# Altium schematic sheet POWER SUPPLY.SchDoc
size 474 x 261 mm
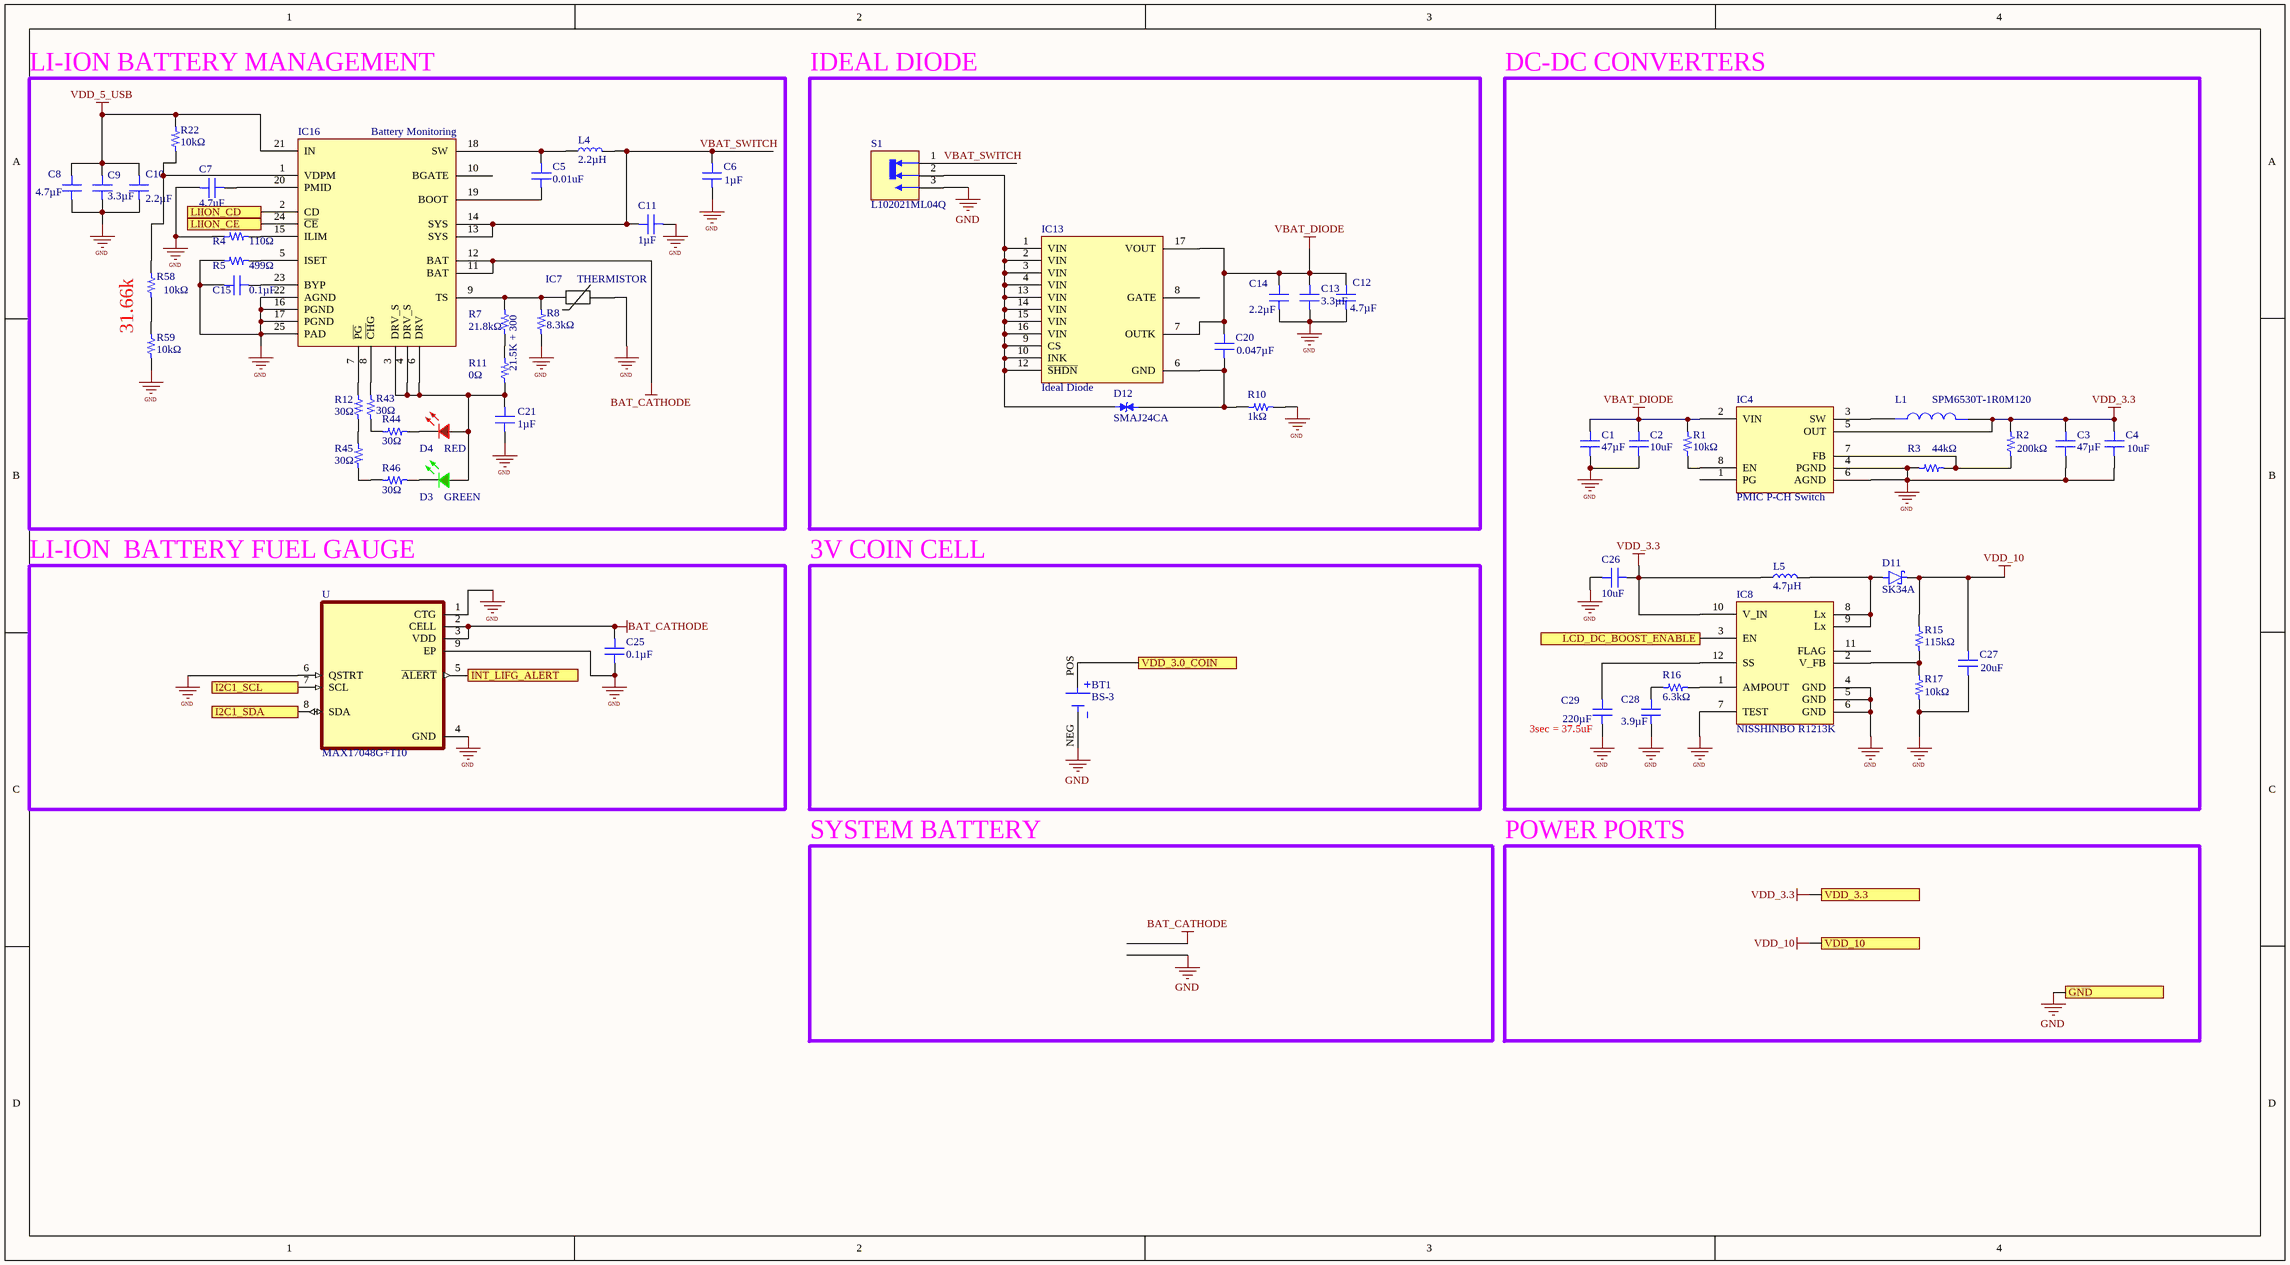
[diagram p0: POWER SUPPLY.SchDoc]

## Parts
BT1  BS-3  [BAT_BS-3]
C1  47µF  [CAP 1210_3225 - 2.2MM]
C2  10uF  [CAP 0603_1608]
C3  47µF  [CAP 1210_3225 - 2.2MM]
C4  10uF  [CAP 0603_1608]
C5  0.01uF  [CAP 0603_1608]
C6  1µF  [CAP 0603_1608]
C7  4.7uF  [CAP 0603_1608]
C8  4.7µF  [CAP 0805_2012]
C9  3.3µF  [0805_2012 RF]  (no BOM)
C10  2.2µF  [CAP 0603_1608]
C11  1µF  [CAP 0603_1608]
C12  4.7µF  [CAP 0805_2012]
C13  3.3µF  [0805_2012 RF]  (no BOM)
C14  2.2µF  [CAP 0603_1608]
C15  0.1µF  [CAP 0603_1608 RF]
C20  0.047µF  [CAP 0603_1608]
C21  1µF  [CAP 0603_1608]
C25  0.1µF  [CAP 0603_1608 RF]
C26  10uF  [CAP 0603_1608]
C27  20uF  [CAP 0603_1608]
C28  3.9µF  [CAP 0805_2012]
C29  220µF  [CAP 0805_2012]
D3  GREEN  [LED 0603_1608]
D4  RED  [LED 0603_1608]
D11  SK34A  [DIOM4325X250N]
D12  SMAJ24CA  [DIOM4325X250N]
IC4  PMIC P-CH Switch  [MPS MP2144 TSOT23-8]
IC7  THERMISTOR  [THERMISTOR 2TH]
IC8  NISSHINBO R1213K  [NISSHINBO R1213K]
IC13  Ideal Diode  [ANALOG DFN-16]
IC16  Battery Monitoring  [TI BQ24278]
L1  SPM6530T-1R0M120  [IND_SPM6530T-1R0M120]
L4  2.2µH  [IND 0806_2016]
L5  4.7µH  [NTC 0603_1608]
R1  10kΩ  [RES 0603_1608 RF]
R2  200kΩ  [RES 0603_1608 RF]
R3  44kΩ  [RES 0603_1608 RF]
R4  110Ω  [RES 0603_1608 RF]
R5  499Ω  [RES 0603_1608 RF]
R7  21.8kΩ  [RES 0603_1608 RF]
R8  8.3kΩ  [RES 0603_1608 RF]
R10  1kΩ  [RES 0603_1608 RF]
R11  0Ω  [RES 0603_1608 RF]
R12  30Ω  [RES 0603_1608 RF]
R15  115kΩ  [RES 0603_1608 RF]
R16  6.3kΩ  [RES 0603_1608 RF]
R17  10kΩ  [RES 0603_1608 RF]
R22  10kΩ  [RES 0603_1608 RF]
R43  30Ω  [RES 0603_1608 RF]
R44  30Ω  [RES 0603_1608 RF]
R45  30Ω  [RES 0603_1608 RF]
R46  30Ω  [RES 0603_1608 RF]
R58  10kΩ  [RES 0603_1608 RF]
R59  10kΩ  [RES 0603_1608 RF]
S1  L102021ML04Q  [SW_L102021ML04Q]
U  MAX17048G+T10  [SON50P200X200X80-9N]

## Blocks framed on the sheet
LI-ION BATTERY MANAGEMENT: C5-C11 C15 C21 D3 D4 IC7 IC16 L4 R4 R5 R7 R8 R11 R12 R22 R43-R46 R58 R59
IDEAL DIODE: C12-C14 C20 D12 IC13 R10 S1
DC-DC CONVERTERS: C1-C4 C26-C29 D11 IC4 IC8 L1 L5 R1-R3 R15-R17
LI-ION  BATTERY FUEL GAUGE: C25 U
3V COIN CELL: BT1

## Ports
GND, I2C1_SCL, I2C1_SDA, INT_LIFG_ALERT, LCD_DC_BOOST_ENABLE, LIION_CD, LIION_CE, VDD_3.0_COIN, VDD_3.3, VDD_10

## Nets
BAT_CATHODE: C25.2 IC16.11(BAT) IC16.12(BAT) U.2(CELL) U.3(VDD)
GND: BT1.NEG C1.1 C2.1 C3.1 C4.1 C6.1 C7.2 C8.1 C9.1 C10.1 C11.1 C12.1 C13.1 C14.1 C15.1 C21.1 C25.1 C26.1 C27.1 C28.1 C29.1 IC4.4(PGND) IC4.6(AGND) IC7.2 IC8.4(GND) IC8.5(GND) IC8.6(GND) IC8.7(TEST) IC16.16(PGND) IC16.17(PGND) IC16.22(AGND) IC16.25(PAD) R3.1 R4.1 R5.1 R8.2 R10.1 R17.1 R59.2 S1.3 U.1(CTG) U.4(GND) U.6(QSTRT) U.9(EP) ; port GND
VBAT_DIODE: C1.2 C2.2 C12.2 C13.2 C14.2 C20.2 IC4.2(VIN) IC13.7(OUTK) IC13.17(VOUT) R1.2
VDD_3.3: C3.2 C4.2 C26.2 IC4.5(OUT) IC8.10(V_IN) L1.2 L5.1 R2.2 ; port VDD_3.3
VDD_5_USB: C8.2 C9.2 C10.2 IC16.21(IN) R22.1
VDD_10: C27.2 D11.C(K) R15.2 ; port VDD_10
I2C1_SCL: U.7(SCL) ; port I2C1_SCL
I2C1_SDA: U.8(SDA) ; port I2C1_SDA
INT_LIFG_ALERT: U.5(~{ALERT}) ; port INT_LIFG_ALERT
LCD_DC_BOOST_ENABLE: IC8.3(EN) ; port LCD_DC_BOOST_ENABLE
LIION_CD: IC16.2(CD) ; port LIION_CD
LIION_CE: IC16.24(~{CE}) ; port LIION_CE
VBAT_SWITCH: C6.2 C11.2 IC16.13(SYS) IC16.14(SYS) L4.2 S1.1
VDD_3.0_COIN: BT1.POS ; port VDD_3.0_COIN
NetC5_1: C5.1 IC16.19(BOOT)
NetC5_2: C5.2 IC16.18(SW) L4.1
NetC7_1: C7.1 IC16.20(PMID)
NetC15_2: C15.2 IC16.23(BYP)
NetC20_1: C20.1 D12.2 IC13.6(GND) R10.2
NetC21_2: C21.2 D3.1 D4.1 IC16.3(DRV_S) IC16.4(DRV_S) IC16.6(DRV) R11.1
NetC28_2: C28.2 R16.1
NetC29_2: C29.2 IC8.12(SS)
NetD3_2: D3.2 R46.1
NetD4_2: D4.2 R44.1
NetD11_A: D11.A IC8.8(Lx) IC8.9(Lx) L5.2
NetD12_1: D12.1 IC13.1(VIN) IC13.2(VIN) IC13.3(VIN) IC13.4(VIN) IC13.9(CS) IC13.10(INK) IC13.12(~{SHDN}) IC13.13(VIN) IC13.14(VIN) IC13.15(VIN) IC13.16(VIN) S1.2
NetIC4_3: IC4.3(SW) L1.1
NetIC4_7: IC4.7(FB) R2.1 R3.2
NetIC4_8: IC4.8(EN) R1.1
NetIC7_1: IC7.1 IC16.9(TS) R7.2 R8.1
NetIC8_1: IC8.1(AMPOUT) R16.2
NetIC8_2: IC8.2(V_FB) R15.1 R17.2
NetIC16_1: IC16.1(VDPM) R22.2 R58.2
NetIC16_5: IC16.5(ISET) R5.2
NetIC16_7: IC16.7(~{PG}) R12.2
NetIC16_8: IC16.8(~{CH}G) R43.2
NetIC16_15: IC16.15(ILIM) R4.2
NetR7_1: R7.1 R11.2
NetR12_1: R12.1 R45.2
NetR43_1: R43.1 R44.2
NetR45_1: R45.1 R46.2
NetR58_1: R58.1 R59.1

Not connected (* = marked no-connect by the designer): IC4 1(PG); IC8 11(FLAG); IC13 8(GATE); IC16 10(BGATE)

## Notes on the sheet
- 31.66k
- 21.5K + 300
- (near C29) 3sec = 37.5uF
- SYSTEM BATTERY
- POWER PORTS
- Title
- Size:
- Date:
- File:
- A2
- Number:
- Time:
- Revision:
- Sheet
- of

## Library data of the parts
BT1 = BS-3: Holder Coincell 2032 Retainr Arm; MF: MPD (Memory; Price: None; Availability: Warning; Package: None; MP: BS-3; Value: *; SnapEDA_Link: https://www.snapeda.com/parts/BS-3/Memory%20Protection%20Devices/view-part/2280959/?ref=snap
C1 C3 = CAP00038: CAP CER 47UF 10V X7R 1210; Manufacturer: Murata Electronics; Manufacturer P/N: GRM32ER71A476ME15L; Tolerance: ±20%; Device ID: CAP00038; Mounting Type: Surface Mount; Part Type: Capacitor; VALUE: 47µF; Operating Temperature: -55°C ~ 125°C; Voltage: 10V; Package: 1210 (3225 Metric); Supplier1: Digi-Key; Supplier1 P/N: 490-6543-1-ND; Supplier2: Mouser; Supplier2 P/N: 81-GRM32ER71A476ME5L; Temperature Coefficient: X7R
C2 C4 C26 = CAP00045: CAP CER 10UF 6.3V X7R 0603; Manufacturer: TDK; Manufacturer P/N: C2012JB0J106M; Tolerance: ±10%; Device ID: CAP00045; Mounting Type: Surface Mount; Part Type: Capacitor; VALUE: 10uF; Operating Temperature: -55°C ~ 125°C; Voltage: 6.3V; Package: 0603 (1608 Metric); Supplier1: Digi-Key; Supplier1 P/N: 399-7891-1-ND; Supplier2: Mouser; Supplier2 P/N: 80-C0603C273K3R; Temperature Coefficient: X7R
C5 = CAP00049: CAP CER 0.01UF 25V X7R 0603; Manufacturer: TDK; Manufacturer P/N: C2012X5R1C106K; Tolerance: ±10%; Device ID: CAP00049; Mounting Type: Surface Mount; Part Type: Capacitor; VALUE: 0.01uF; Operating Temperature: -55°C ~ 125°C; Voltage: 25V; Package: 0603 (1608 Metric); Supplier1: Digi-Key; Supplier1 P/N: 399-7891-1-ND; Supplier2: Mouser; Supplier2 P/N: 80-C0603C273K3R; Temperature Coefficient: X7R
C6 C11 C21 = CAP00007: CAP CER 1UF 10V X7R 0603; Manufacturer: KEMET; Manufacturer P/N: C0603C105K8RACTU; Tolerance: ±10%; Device ID: CAP00007; Mounting Type: Surface Mount; Part Type: Capacitor; VALUE: 1µF; Operating Temperature: -55°C ~ 125°C; Voltage: 10V; Package: 0603 (1608 Metric); Supplier1: Digi-Key; Supplier1 P/N: 399-11133-1-ND; Supplier2: Mouser; Supplier2 P/N: 80-C0603C105K8R; Temperature Coefficient: X7R
C7 = CAP00044: CAP CER 4.7UF 50V X7R 0603; Manufacturer: KEMET; Manufacturer P/N: CL10A475KQ8NNNC; Voltage: 25V; Tolerance: ±10%; Device ID: CAP00044; Mounting Type: Surface Mount; Part Type: Capacitor; VALUE: 4.7uF; Operating Temperature: -55°C ~ 125°C; Package: 0603 (1608 Metric); Supplier1: Digi-Key; Supplier1 P/N: 399-7891-1-ND; Supplier2: Mouser; Supplier2 P/N: 80-C0603C273K3R; Temperature Coefficient: X7R
C8 C12 = CAP00014: CAP CER 4.7UF 16V X7R 0805; Manufacturer: KEMET; Manufacturer P/N: C0805C475K4RACTU; Tolerance: ±10%; Device ID: CAP00014; Mounting Type: Surface Mount; Part Type: Capacitor; VALUE: 4.7µF; Operating Temperature: -55°C ~ 125°C; Voltage: 16V; Package: 0805 (2012 Metric); Supplier1: Digi-Key; Supplier1 P/N: 399-7415-1-ND; Supplier2: Mouser; Supplier2 P/N: C0805C475K4RACTU; Temperature Coefficient: X7R
C9 C13 = CAP0004A: CAP CER 3.3UF 16V X7R 0805; Manufacturer: KEMET; Manufacturer P/N: C0805C475K4RACTU; Tolerance: ±10%; Device ID: CAP0004A; Mounting Type: Surface Mount; Part Type: Capacitor; VALUE: 3.3µF; Operating Temperature: -55°C ~ 125°C; Voltage: 16V; Package: 0805 (2012 Metric); Supplier1: Digi-Key; Supplier1 P/N: 399-7415-1-ND; Supplier2: Mouser; Supplier2 P/N: C0805C475K4RACTU; Temperature Coefficient: X7R
C10 C14 = CAP0000A: CAP CER 2.2UF 10V X7R 0603; Manufacturer: KEMET; Manufacturer P/N: C0603C225M8RACTU; Tolerance: ±20%; Device ID: CAP0000A; Mounting Type: Surface Mount; Part Type: Capacitor; VALUE: 2.2µF; Operating Temperature: -55°C ~ 125°C; Voltage: 10V; Package: 0603 (1608 Metric); Supplier1: Digi-Key; Supplier1 P/N: 399-11682-1-ND; Supplier2: Mouser; Supplier2 P/N: 80-C0603C225M8R; Temperature Coefficient: X7R
C15 C25 = CAP00039: CAP CER 0.1UF 16V X7R 0603; Manufacturer: KEMET; Manufacturer P/N: C0603C104M4RACAUTO; Tolerance: ±20%; Device ID: CAP00039; Mounting Type: Surface Mount; Part Type: Capacitor; VALUE: 0.1µF; Operating Temperature: -55°C ~ 125°C; Voltage: 16V; Package: 0603 (1608 Metric); Supplier1: Digi-Key; Supplier1 P/N: 399-C0603C104M4RACAUTOCT-ND; Supplier2: Mouser; Supplier2 P/N: C0603C104M4RACAUTO; Temperature Coefficient: X7R
C20 = CAP0000E: CAP CER 0.047UF 50V X7R 0603; Manufacturer: KEMET; Manufacturer P/N: C0603C473K5RACTU; Tolerance: ±10%; Device ID: CAP0000E; Mounting Type: Surface Mount; Part Type: Capacitor; VALUE: 0.047µF; Operating Temperature: -55°C ~ 125°C; Voltage: 50V; Package: 0603 (1608 Metric); Supplier1: Digi-Key; Supplier1 P/N: 399-7933-1-ND; Supplier2: Mouser; Supplier2 P/N: 80-C0603C473K5R; Temperature Coefficient: X7R
C27 = CAP00046: CAP CER 20UF 25V X7R 0603; Manufacturer: TDK; Manufacturer P/N: C2012X5R1C106K; Tolerance: ±10%; Device ID: CAP00046; Mounting Type: Surface Mount; Part Type: Capacitor; VALUE: 20uF; Operating Temperature: -55°C ~ 125°C; Voltage: 25V; Package: 0603 (1608 Metric); Supplier1: Digi-Key; Supplier1 P/N: 399-7891-1-ND; Supplier2: Mouser; Supplier2 P/N: 80-C0603C273K3R; Temperature Coefficient: X7R
C28 = CAP0004B: CAP CER 3.9UF 50V X7R 0805; Manufacturer: KEMET; Manufacturer P/N: C0805C223K5RAC7210; Tolerance: ±10%; Device ID: CAP0004B; Mounting Type: Surface Mount; Part Type: Capacitor; VALUE: 3.9µF; Operating Temperature: -55°C ~ 125°C; Voltage: 50V; Package: 0805 (2012 Metric); Supplier1: Digi-Key; Supplier1 P/N: 399-C0805C223K5RAC7210CT-ND; Supplier2: Mouser; Supplier2 P/N: 80-C0805C223K5RACLR; Temperature Coefficient: X7R
C29 = CAP0004C: CAP CER 220UF 50V X7R 0805; Manufacturer: KEMET; Manufacturer P/N: C0805C223K5RAC7210; Tolerance: ±10%; Device ID: CAP0004C; Mounting Type: Surface Mount; Part Type: Capacitor; VALUE: 220µF; Operating Temperature: -55°C ~ 125°C; Voltage: 50V; Package: 0805 (2012 Metric); Supplier1: Digi-Key; Supplier1 P/N: 399-C0805C223K5RAC7210CT-ND; Supplier2: Mouser; Supplier2 P/N: 80-C0805C223K5RACLR; Temperature Coefficient: X7R
D3 = LED0000B: LED RED CLEAR 0603 SMD; Manufacturer: Würth Elektronik; Manufacturer P/N: 150060RS75000; If - Forward Current: 100mA; Vf - Forward Voltage: 2.0V; Wavelength: 625nm; Viewing Angle: 140°; Lens Color: Colorless; Device ID: LED0000B; VALUE: GREEN; Mounting Type: Surface Mount; Part Type: LED; Operating Temperature: -40°C ~ 85°C; Package: 0603 (1608 Metric); Color: Red; Supplier1: Digi-Key; Supplier1 P/N: 732-4978-1-ND
D4 = LED0000A: LED RED CLEAR 0603 SMD; Manufacturer: Würth Elektronik; Manufacturer P/N: 150060RS75000; If - Forward Current: 100mA; Vf - Forward Voltage: 2.0V; Wavelength: 625nm; Viewing Angle: 140°; Lens Color: Colorless; Device ID: LED0000A; VALUE: RED; Mounting Type: Surface Mount; Part Type: LED; Operating Temperature: -40°C ~ 85°C; Package: 0603 (1608 Metric); Color: Red; Supplier1: Digi-Key; Supplier1 P/N: 732-4978-1-ND
IC4 = SWT00003: IC PWR SWITCH P-CHAN 1:1 4TDFN; Manufacturer: Vishay Siliconix; Manufacturer P/N: SIP32432DNP3-T1GE4; Switch Type: General Purpose; Number of Outputs: 1; Output Configuration: High Side; Output Type: P-Channel; Interface: On/Off; Voltage - Load: 1.5V ~ 5.5V; Voltage - Supply (Vcc/Vdd): Not Required; Current - Output (Max): 1.4A; Rds On (Typ): 105mOhm; Input Type: Non-Inverting; Fault Protection: Reverse Current; Device ID: SWT00003; Part Type: IC; VALUE: PMIC P-CH Switch; Operating Temperature: -40°C ~ 85°C (TA); Package: 4-TDFN (1.2x1.6); Ratio - Input:Output: 1:1; Features: Slew Rate Controlled; Supplier1: Digi-Key; Supplier1 P/N: SIP32432DNP3-T1GE4CT-ND; Supplier2: Mouser; Supplier2 P/N: 78-SIP32432DNP3T1GE4
IC7 = TMP00002: 10kΩ THERMISTOR 0603; Manufacturer: Texas Instruments; VALUE: -40°C ~ 125°C Temp Sense; Sensor Type: Digital, Local; Sensing Temperature - Local: -40°C ~ 125°C; Output Type: I²C/SMBus; Voltage - Supply: 1.4V ~ 3.6V; Resolution: 8b; Accuracy - Highest (Lowest): ±2°C (±3°C); Test Condition: -10°C ~ 100°C (-40°C ~ 125°C); Device ID: TMP00002; Part Type: IC; Operating Temperature: -40°C ~ 125°C; Package: 4-DSBGA; Mounting Type: Surface Mount; Sensing Temperature - Remote: -; Features: One-Shot, Shutdown Mode; Supplier1: Digi-Key; Supplier1 P/N: 296-28398-1-ND; Supplier2: Mouser; Supplier2 P/N: 595-TMP103AYFFT
IC8 = VRG00006: IC REG CONV BLUETTH 1OUT 12WSON; Manufacturer: Texas Instruments; Manufacturer P/N: TPS62740DSSR; VALUE: Buck Regulator; Voltage - Input (Max): 2.5V; Voltage - Input (Min): 2.2V; Voltage - Output (Max): 3.3V; Current - Output: 300mA; Number of Outputs: 2; Voltage - Output (Min/Fixed): 1.8V; Frequency - Switching: 2MHz; Function: Step-Down; Device ID: VRG00006; Part Type: IC; Operating Temperature: -40°C ~ 85°C (TA); Package: 12-WSON; Supplier1: Digi-Key; Supplier1 P/N: 296-39459-1-ND; Synchronous Rectifier: -; Supplier2: Mouser; Supplier2 P/N: 595-TPS62740DSSR; Mounting Type: Surface Mount
IC13 = DCN00001: IC OR CTRLR IDEAL DIODE SC70-6; Manufacturer: Texas Instruments; Manufacturer P/N: LM66100DCKR; FET Type: P-Channel; Ratio - Input:Output: 1:1; Internal Switch(s): Yes; Current - Output (Max): 1.5A; Voltage - Supply: 1.5V ~ 5.5V; Delay Time - ON: 27 µs; Delay Time - OFF: 2 µs; Device ID: DCN00001; Part Type: IC; VALUE: Ideal Diode; Operating Temperature: -40°C ~ 105°C; Package: SOT-363; Mounting Type: Surface Mount; Applications: General Purpose; Supplier1: Digi-Key; Supplier1 P/N: 296-53541-1-ND; Supplier2: Mouser; Supplier2 P/N: 595-LM66100DCKR
IC16 = BMG00003: IC BATT MON LI-ION 1CELL 24QFN; Manufacturer: Analog Devices Inc.; Manufacturer P/N: BQ24278; Number of Cells: 1; Interface: I²C; Device ID: BMG00003; Part Type: IC; VALUE: Battery Monitoring; Operating Temperature: -40°C ~ 125°C; Package: 12-LFCSP Exposed Pad; Function: Battery Monitor; Fault Protection: -; Supplier1: Digi-Key; Supplier1 P/N: TBD; Supplier2: Mouser; Supplier2 P/N: TBD
L1 = SPM6530T-1R0M120: 1 ÂµH Shielded Drum Core, Wirewound Inductor 13 A 7.81mOhm Max Nonstandard; MF: TDK; Availability: In Stock; Package: NON STANDARD-2 TDK; MP: SPM6530T-1R0M120; Value: *; SnapEDA_Link: https://www.snapeda.com/parts/SPM6530T-1R0M120/TDK/view-part/?ref=snap; Price: None; Purchase-URL: https://pricing.snapeda.com/search/part/SPM6530T-1R0M120/?ref=eda; Check_prices: https://www.snapeda.com/parts/SPM6530T-1R0M120/TDK/view-part/?ref=eda
L4 = IND00002: FIXED IND 2.2UH 1.8A 139 MOHM; Manufacturer: Samsung Electro-Mechanics; Manufacturer P/N: CIGT201610LH2R2MNE; Current Saturation: 2.3A; Tolerance: ±20%; DC Resistance: 0.139Ω; Material - Core: Metal Composite; Device ID: IND00002; Part Type: Inductor; VALUE: 2.2µH; Operating Temperature: -40°C ~ 125°C; Package: 0806 (2016 Metric); Supplier1: Digi-Key; Supplier1 P/N: 1276-6911-1-ND; Supplier2: Mouser; Supplier2 P/N: 187-CIGT201610LH2R2M; Q @ Freq: -; Frequency - Self Resonant: -; Mounting Type: Surface Mount
L5 = IND00003: FIXED IND 4.7UH 16V; Manufacturer: TDK Corporation; Manufacturer P/N: C2012X5R1C106K; Current Saturation: 90mA; Tolerance: ±20%; DC Resistance: 1.050Ω; Material - Core: Ferrite; Device ID: IND00003; Part Type: Inductor; VALUE: 4.7µH; Operating Temperature: -55°C ~ 125°C; Package: 0603 (1608 Metric); Supplier1: Digi-Key; Supplier1 P/N: 445-175588-1-ND; Supplier2: Mouser; Supplier2 P/N: 810-MLZ1608M100WTD25; Q @ Freq: -; Frequency - Self Resonant: -; Mounting Type: Surface Mount
R1 R17 R22 R58 R59 = RES0002B: RES 10k OHM 1% 1/10W 0603; Manufacturer: Vishay Dale; Manufacturer P/N: ‎CRCW0603820KFKEAC‎; Power: 0.100W; Device ID: RES0002B; VALUE: 10kΩ; Mounting Type: Surface Mount; Part Type: Resistor; Operating Temperature: -55°C ~ 155°C; Package: 0603 (1608 Metric); Tolerance: ±1%; Composition: Thick Film; Supplier1: Digi-Key; Supplier1 P/N: ‎541-5568-1-ND‎; Supplier2: Mouser; Supplier2 P/N: 71-CRCW0603820KFKEAC
R2 = RES0002F: RES 200k OHM 1% 1/10W 0603; Manufacturer: Vishay Dale; Manufacturer P/N: ‎CRCW0603820KFKEAC‎; Power: 0.100W; Device ID: RES0002F; VALUE: 200kΩ; Mounting Type: Surface Mount; Part Type: Resistor; Operating Temperature: -55°C ~ 155°C; Package: 0603 (1608 Metric); Tolerance: ±1%; Composition: Thick Film; Supplier1: Digi-Key; Supplier1 P/N: ‎541-5568-1-ND‎; Supplier2: Mouser; Supplier2 P/N: 71-CRCW0603820KFKEAC
R3 = RES0002E: RES 44k OHM 1% 1/10W 0603; Manufacturer: Vishay Dale; Manufacturer P/N: ‎CRCW0603820KFKEAC‎; Power: 0.100W; Device ID: RES0002E; VALUE: 44kΩ; Mounting Type: Surface Mount; Part Type: Resistor; Operating Temperature: -55°C ~ 155°C; Package: 0603 (1608 Metric); Tolerance: ±1%; Composition: Thick Film; Supplier1: Digi-Key; Supplier1 P/N: ‎541-5568-1-ND‎; Supplier2: Mouser; Supplier2 P/N: 71-CRCW0603820KFKEAC
R4 = RES00032: RES 110 OHM 1% 1/10W 0603; Manufacturer: Vishay Dale; Manufacturer P/N: ‎CRCW0603820KFKEAC‎; Power: 0.100W; Device ID: RES00032; VALUE: 110Ω; Mounting Type: Surface Mount; Part Type: Resistor; Operating Temperature: -55°C ~ 155°C; Package: 0603 (1608 Metric); Tolerance: ±1%; Composition: Thick Film; Supplier1: Digi-Key; Supplier1 P/N: ‎541-5568-1-ND‎; Supplier2: Mouser; Supplier2 P/N: 71-CRCW0603820KFKEAC
R5 = RES00016: RES SMD 499 OHM 1% 1/10W 0603; Manufacturer: Vishay Dale; Manufacturer P/N: CRCW0603499RFKEA; Power: 0.100W; Device ID: RES00016; VALUE: 499Ω; Mounting Type: Surface Mount; Part Type: Resistor; Operating Temperature: -55°C ~ 155°C; Package: 0603 (1608 Metric); Tolerance: ±1%; Composition: Thick Film; Supplier1: Digi-Key; Supplier1 P/N: 541-499HCT-ND; Supplier2: Mouser; Supplier2 P/N: 71-CRCW0603-499-E3
R7 = RES00031: RES 21.8k OHM 1% 1/10W 0603; Manufacturer: Vishay Dale; Manufacturer P/N: ‎CRCW0603820KFKEAC‎; Power: 0.100W; Device ID: RES00031; VALUE: 21.8kΩ; Mounting Type: Surface Mount; Part Type: Resistor; Operating Temperature: -55°C ~ 155°C; Package: 0603 (1608 Metric); Tolerance: ±1%; Composition: Thick Film; Supplier1: Digi-Key; Supplier1 P/N: ‎541-5568-1-ND‎; Supplier2: Mouser; Supplier2 P/N: 71-CRCW0603820KFKEAC
R8 = RES00030: RES 8.3k OHM 1% 1/10W 0603; Manufacturer: Vishay Dale; Manufacturer P/N: ‎CRCW0603820KFKEAC‎; Power: 0.100W; Device ID: RES00030; VALUE: 8.3kΩ; Mounting Type: Surface Mount; Part Type: Resistor; Operating Temperature: -55°C ~ 155°C; Package: 0603 (1608 Metric); Tolerance: ±1%; Composition: Thick Film; Supplier1: Digi-Key; Supplier1 P/N: ‎541-5568-1-ND‎; Supplier2: Mouser; Supplier2 P/N: 71-CRCW0603820KFKEAC
R10 = RES0000B: RES SMD 1K OHM 0.1% 1/10W 0603; Manufacturer: Susumu; Manufacturer P/N: RG1608P-102-B-T5; Power: 0.100W; Device ID: RES0000B; VALUE: 1kΩ; Mounting Type: Surface Mount; Part Type: Resistor; Operating Temperature: -55°C ~ 155°C; Package: 0603 (1608 Metric); Tolerance: ±0.1%; Composition: Thin Film; Supplier1: Digi-Key; Supplier1 P/N: RG16P1.0KBCT-ND; Supplier2: Mouser; Supplier2 P/N: 754-RG1608P-102-B-T5
R11 = RES00033: RES 0 OHM 1% 1/10W 0603; Manufacturer: Vishay Dale; Manufacturer P/N: ‎CRCW0603820KFKEAC‎; Power: 0.100W; Device ID: RES00033; VALUE: 0Ω; Mounting Type: Surface Mount; Part Type: Resistor; Operating Temperature: -55°C ~ 155°C; Package: 0603 (1608 Metric); Tolerance: ±1%; Composition: Thick Film; Supplier1: Digi-Key; Supplier1 P/N: ‎541-5568-1-ND‎; Supplier2: Mouser; Supplier2 P/N: 71-CRCW0603820KFKEAC
R12 R43-R46 = RES00039: RES 30 OHM 1% 1/10W 0603; Manufacturer: Vishay Dale; Manufacturer P/N: ‎CRCW0603820KFKEAC‎; Power: 0.100W; Device ID: RES00039; VALUE: 30Ω; Mounting Type: Surface Mount; Part Type: Resistor; Operating Temperature: -55°C ~ 155°C; Package: 0603 (1608 Metric); Tolerance: ±1%; Composition: Thick Film; Supplier1: Digi-Key; Supplier1 P/N: ‎541-5568-1-ND‎; Supplier2: Mouser; Supplier2 P/N: 71-CRCW0603820KFKEAC
R15 = RES0002C: RES 115k OHM 1% 1/10W 0603; Manufacturer: Vishay Dale; Manufacturer P/N: ‎CRCW0603820KFKEAC‎; Power: 0.100W; Device ID: RES0002C; VALUE: 115kΩ; Mounting Type: Surface Mount; Part Type: Resistor; Operating Temperature: -55°C ~ 155°C; Package: 0603 (1608 Metric); Tolerance: ±1%; Composition: Thick Film; Supplier1: Digi-Key; Supplier1 P/N: ‎541-5568-1-ND‎; Supplier2: Mouser; Supplier2 P/N: 71-CRCW0603820KFKEAC
R16 = RES0002D: RES 6.3k OHM 1% 1/10W 0603; Manufacturer: Vishay Dale; Manufacturer P/N: ‎CRCW0603820KFKEAC‎; Power: 0.100W; Device ID: RES0002D; VALUE: 6.3kΩ; Mounting Type: Surface Mount; Part Type: Resistor; Operating Temperature: -55°C ~ 155°C; Package: 0603 (1608 Metric); Tolerance: ±1%; Composition: Thick Film; Supplier1: Digi-Key; Supplier1 P/N: ‎541-5568-1-ND‎; Supplier2: Mouser; Supplier2 P/N: 71-CRCW0603820KFKEAC
S1 = L102021ML04Q: Slide Switch SPDT Through Hole, Right Angle; MF: C&K; Price: None; Purchase-URL: https://pricing.snapeda.com/search/part/L102021ML04Q/?ref=eda; Value: *; Check_prices: https://www.snapeda.com/parts/L102021ML04Q/C&K/view-part/458072/?ref=eda; Package: None; SnapEDA_Link: https://www.snapeda.com/parts/L102021ML04Q/C&K/view-part/458072/?ref=snap; MP: L102021ML04Q; Availability: Good
U = MAX17048G+T10: Battery Battery Monitor IC Lithium-Ion 8-TDFN-EP (2x2); MF: Maxim Integrated; Package: TDFN-8 Maxim; SnapEDA_Link: https://www.snapeda.com/parts/MAX17048G+T10/Maxim%20Integrated/view-part/329239/?ref=snap; Mouser-Purchase-URL: https://snapeda.com/shop?store=Mouser&id=329239; MP: MAX17048G+T10; Digi-Key_Part_Number: MAX17048G+T10CT-ND; Value: *
D11 = SK34A: Price: None; Availability: Unavailable; Value: *; MP: SK34A; Package: None
D12 = SMAJ24CA: Value: *; Package: None; Price: None; Availability: Unavailable; MP: SMAJ24CA